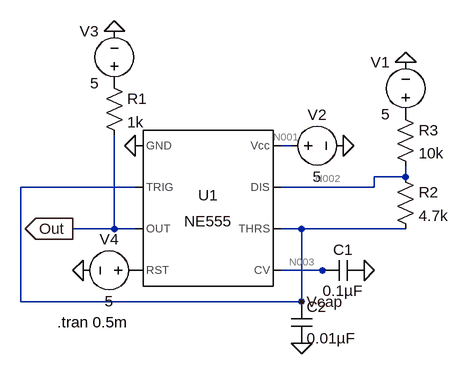
[diagram p0: schematic Lab7a.asc]
Lab7a.asc, the LTspice schematic file:
Version 4
SHEET 1 880 680
WIRE 272 128 256 128
WIRE 448 176 448 160
WIRE 448 176 400 176
WIRE 32 192 -144 192
WIRE 400 192 400 176
WIRE 400 192 256 192
WIRE 0 256 0 112
WIRE 0 256 -64 256
WIRE 32 256 0 256
WIRE 288 256 256 256
WIRE 448 256 288 256
WIRE 320 320 256 320
WIRE 336 320 320 320
WIRE -144 368 -144 192
WIRE 288 368 288 256
WIRE 288 368 -144 368
FLAG 32 128 0
FLAG -64 256 Out
IOPIN -64 256 Out
FLAG 352 128 0
FLAG 0 -48 0
FLAG -48 320 0
FLAG 384 320 0
FLAG 288 432 0
FLAG 288 368 Vcap
FLAG 448 0 0
SYMBOL Misc\\NE555 144 224 R0
SYMATTR InstName U1
SYMBOL voltage 256 128 R270
WINDOW 0 32 56 VTop 2
WINDOW 3 -32 56 VBottom 2
SYMATTR InstName V2
SYMATTR Value 5
SYMBOL res -16 16 R0
SYMATTR InstName R1
SYMATTR Value 1k
SYMBOL voltage 0 48 R180
WINDOW 0 24 96 Left 2
WINDOW 3 24 16 Left 2
SYMATTR InstName V3
SYMATTR Value 5
SYMBOL voltage 48 320 R90
WINDOW 0 -32 56 VBottom 2
WINDOW 3 32 56 VTop 2
SYMATTR InstName V4
SYMATTR Value 5
SYMBOL cap 320 336 R270
WINDOW 0 32 32 VTop 2
WINDOW 3 0 32 VBottom 2
SYMATTR InstName C1
SYMATTR Value 0.1µF
SYMBOL cap 272 368 R0
SYMATTR InstName C2
SYMATTR Value 0.01µF
SYMBOL res 432 160 R0
SYMATTR InstName R2
SYMATTR Value 4.7k
SYMBOL res 432 64 R0
SYMATTR InstName R3
SYMATTR Value 10k
SYMBOL voltage 448 96 R180
WINDOW 0 24 96 Left 2
WINDOW 3 24 16 Left 2
SYMATTR InstName V1
SYMATTR Value 5
TEXT -88 400 Left 2 !.tran 0.5m

The netlist it stands for:
* Lab7a.asc
XU1 0 Vcap Out P001 N003 Vcap N002 N001 NE555  ; pins GND TRIG OUT RST CV THRS DIS Vcc
V2 N001 0 5
R1 P002 Out 1k
V3 P002 0 5
V4 P001 0 5
C1 N003 0 0.1µF
C2 Vcap 0 0.01µF
R2 N002 Vcap 4.7k
R3 P003 N002 10k
V1 P003 0 5
.tran 0.5m
.lib NE555.sub
.backanno
.end

* Results of the author's LTspice run, read from the files saved beside the schematic
* Operating Point, zero values left out:
*   V(vcap) = 5 V
*   V(n003) = 3.333 V
*   V(n001) = 5 V
*   V(n002) = 5 V
*   V(out) = 5 V
*   V(p001) = 5 V
*   V(p002) = 5 V
*   V(p003) = 5 V
*   I(R3) = 16.67 nA
*   I(R2) = 10 nA
*   I(R1) = 29.82 nA
*   I(V1) = -16.67 nA
*   I(V4) = -22.67 µA
*   I(V3) = -29.82 nA
*   I(V2) = -1.588 mA
*   Ix(u1:1) = -1.611 mA
*   Ix(u1:2) = 5 nA
*   Ix(u1:3) = 29.82 nA
*   Ix(u1:4) = 22.67 µA
*   Ix(u1:6) = 5 nA
*   Ix(u1:7) = 6.671 nA
*   Ix(u1:8) = 1.588 mA
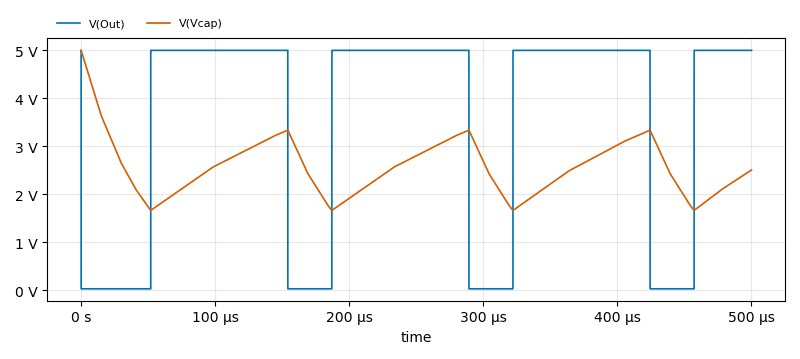
[diagram p1: Transient Analysis of Lab7a.asc, plotted from the saved traces]
* Transient Analysis, 1 run:
*   V(Out): min 29.85 mV, max 5 V, average 3.504 V, rms 4.18 V, last 5 V
*   V(Vcap): min 1.663 V, max 5 V, average 2.557 V, rms 2.64 V, last 2.506 V